# EAGLE design Puzzle_4-Digit Display v2.0 (EAGLE 6.6.0)
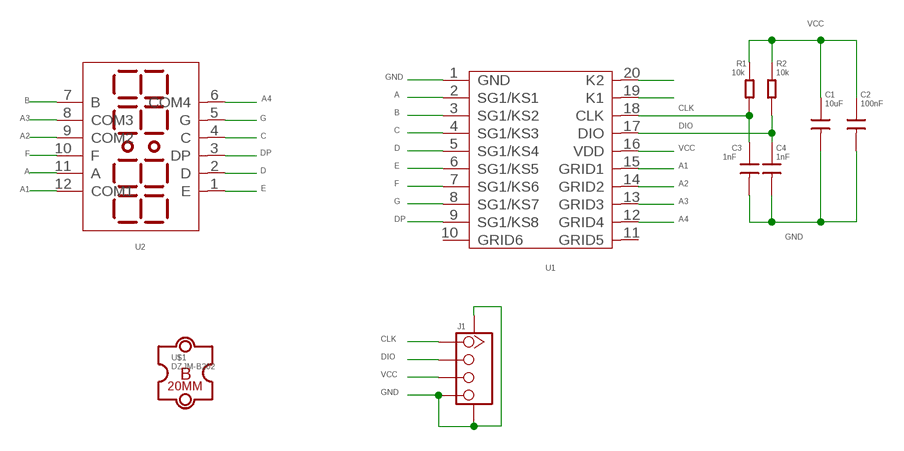
[diagram p0: schematic, sheet 1]

## Parts
C1  10uF  C-0603  [0603]
C2  100nF  C-0603  [0603]
C3  1nF  C-0603  [0603]
C4  1nF  C-0603  [0603]
J1  TWIG-4P-2.0-SMD-FEMALE-REINFORCE'90D'  [4P-SMD-2.0-90D]
R1  10k  R-0603  [0603]
R2  10k  R-0603  [0603]
U1  TM1637  [SOP20-10.45]
U2  LED-4-BETY-7-SEG  [7-4-BYTE-SEG-2.54-30X14X7.3H]
U$1  DZJM-B202  [DZJM-B20-2P]

## Nets
A: U1.2(SG1/KS1) U2.11(A)
A1: U1.15(GRID1) U2.12(COM1)
A2: U1.14(GRID2) U2.9(COM2)
A3: U1.13(GRID3) U2.8(COM3)
A4: U1.12(GRID4) U2.6(COM4)
B: U1.3(SG1/KS2) U2.7(B)
C: U1.4(SG1/KS3) U2.4(C)
CLK: C3.1 J1.1 R1.2 U1.18(CLK)
D: U1.5(SG1/KS4) U2.2(D)
DIO: C4.1 J1.2 R2.2 U1.17(DIO)
DP: U1.9(SG1/KS8) U2.3(DP)
E: U1.6(SG1/KS5) U2.1(E)
F: U1.7(SG1/KS6) U2.10(F)
G: U1.8(SG1/KS7) U2.5(G)
GND: C1.2 C2.2 C3.2 C4.2 J1.4 J1.SS1 J1.SS2 U1.1(GND)
N$17: U1.19(K1)
N$18: U1.20(K2)
VCC: C1.1 C2.1 J1.3 R1.1 R2.1 U1.16(VDD)
Unconnected: U1.10(GRID6) U1.11(GRID5)

## Library data of the parts
C1-C4 = Discrete:C*: Ceramic Capacitors
J1 = Connector:TWIG-4P-2.0-SMD-FEMALE-REINFORCE
R1 R2 = Discrete:R*
U1 = IC:TM1637
U2 = Module:LED-4-BETY-7-SEG
U$1 = duinofun-outline:DZJM-B20

## Board
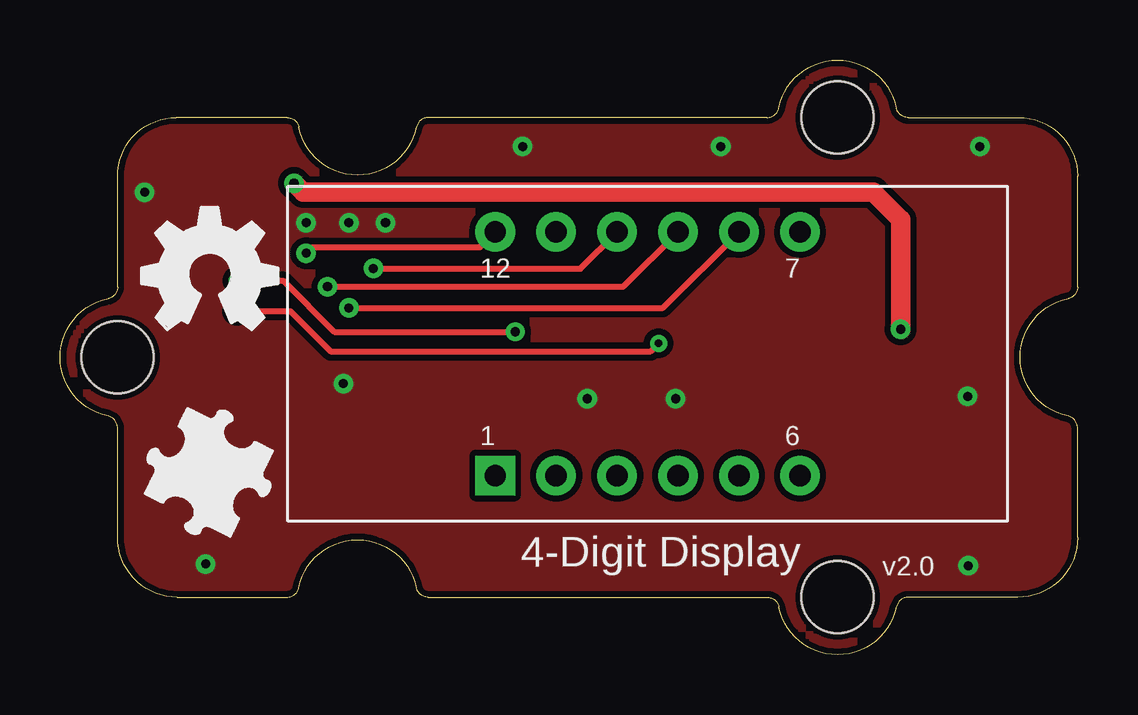
[diagram p1: board, top side]
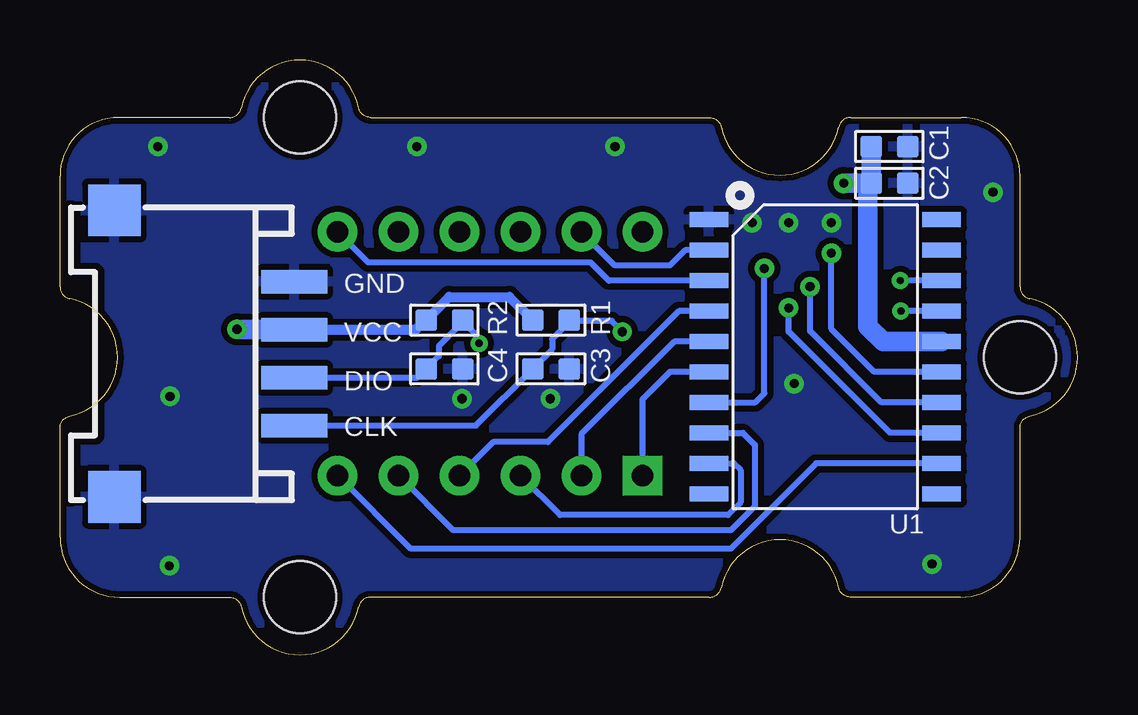
[diagram p2: board, bottom side, seen from below]

Size 42.4 x 24.8 mm. Coordinates in mm from the lower left corner, seen from the top.
Copper layers (1*16): Top 0.035mm / dielectric 1.5mm / Bottom 0.035mm
Design rules "default": minimum track width 10mil, minimum drill 12mil, track to track 8mil, track to pad 8mil, pad to pad 8mil, via to via 8mil, smd to smd 8mil, copper to edge 6mil, drill to drill 8mil, minimum pad ring 10mil, minimum via ring 8mil, stop-mask expansion 4mil, vias tented up to drill 100mil, thermal gap 10mil

### Footprints (pad centres in the part's own frame; a part is rotated, then mirrored left to right if it is on the bottom)
0603 = smd 0.889 x 0.889: 1 -0.762,0; 2 0.762,0
4P-SMD-2.0-90D = smd 0.965 x 2.74: 1 -3,-0.1; 2 -1,-0.1; 3 1,-0.1; 4 3,-0.1 | smd 2.159 x 2.184: SS1 -5.974,7.4; SS2 5.974,7.4
SOP20-10.45 = smd 0.635 x 1.6: 1 -5.715,-4.85; 2 -4.445,-4.85; 3 -3.175,-4.85; 4 -1.905,-4.85; 5 -0.635,-4.85; 6 0.635,-4.85; 7 1.905,-4.85; 8 3.175,-4.85; 9 4.445,-4.85; 10 5.715,-4.85; 11 5.715,4.85; 12 4.445,4.85; 13 3.175,4.85; 14 1.905,4.85; 15 0.635,4.85; 16 -0.635,4.85; 17 -1.905,4.85; 18 -3.175,4.85; 19 -4.445,4.85; 20 -5.715,4.85
7-4-BYTE-SEG-2.54-30X14X7.3H = drill 0.889 pad 1.651 square: 1 -6.35,-5.08 | drill 0.889 pad 1.651: 2 -3.81,-5.08; 3 -1.27,-5.08; 4 1.27,-5.08; 5 3.81,-5.08; 6 6.35,-5.08; 7 6.35,5.08; 8 3.81,5.08; 9 1.27,5.08; 10 -1.27,5.08; 11 -3.81,5.08; 12 -6.35,5.08
DZJM-B20-2P = hole 3: -10,10; -10,-10; 20,0

### Placement (x,y rotation side)
C1  7.85,21.19 0 bottom
C2  7.85,19.66 0 bottom
C3  21.94,11.92 0 bottom
C4  26.39,11.92 0 bottom
J1  32.74,12.55 90 bottom
R1  21.94,13.95 0 bottom
R2  26.39,13.95 0 bottom
U1  10.51,12.43 270 bottom
U2  24.48,12.55 0 top
U$1  22.4,12.4 180 top
U$2  [BRICK-LOGO-2-B-MIL-0.6]  9.24,4.55 0 bottom
U$12  [OSHW_FILLX200_NOTEXT]  3.4,13.57 0 top

### Tracks (layer width: path | path; a pad name or v marks a point on that pad's centre or on a via)
A
  Bottom 0.254: U1.2 16.36,16.87 16.99,16.24 19.28,16.24 U2.11
A1  (via drill 0.38 pad 0.81)
  Top 0.254: v10.26,16.74 10.51,17 17.5,17 U2.12
  Bottom 0.254: U1.15 8.46,11.79 10.26,13.59 v10.26,16.74
A2  (via drill 0.38 pad 0.81)
  Top 0.254: v11.15,15.35 23.47,15.35 U2.9
  Bottom 0.254: U1.14 8.17,10.52 11.15,13.5 v11.15,15.35
A3  (via drill 0.38 pad 0.81)
  Top 0.254: v12.04,14.46 25.12,14.46 U2.8
  Bottom 0.254: U1.13 7.82,9.25 12.04,13.47 v12.04,14.46
A4
  Bottom 0.254: U1.12 10.89,7.98 14.45,4.42 27.79,4.42 U2.6
B
  Bottom 0.254: U1.3 19.53,15.6 20.29,16.36 29.56,16.36 U2.7
C
  Bottom 0.254: U1.4 16.61,14.33 22.07,8.87 24.36,8.87 U2.4
CLK  (via drill 0.3 pad 0.64, 0.38 pad 0.3)
  Top 0.254: v7.39,15.6 9.29,15.6 11.43,13.47 v18.97,13.47
  Bottom 0.254: 21.18,13.92 21.18,13.87 21.89,13.16 21.89,12.73 C3.1 25.07,9.55 J1.1 | U1.18 v7.39,15.6 | v18.97,13.47 18.97,13.49 19.4,13.92 21.18,13.92 | 21.18,13.92 21.23,13.97 | 21.18,13.92 R1.2
D
  Bottom 0.254: U1.5 16.81,13.06 20.67,9.2 U2.2
DIO  (via drill 0.3 pad 0.64)
  Top 0.254: v7.36,14.33 9.6,14.33 11.28,12.65 24.61,12.65 v24.94,12.98
  Bottom 0.254: J1.2 27.52,11.55 C4.1 26.62,12.45 26.62,12.88 25.63,13.87 25.63,13.9 | R2.2 25.63,13.9 | U1.17 v7.36,14.33 | v24.94,12.98 24.94,13.21 25.63,13.9
DP
  Bottom 0.254: U1.9 14.32,7.98 14.05,7.7 14.05,6.35 14.58,5.82 21.56,5.82 U2.3
E
  Bottom 0.254: U1.6 16.99,11.79 18.13,10.65 U2.1 18.13,7.35
F  (via drill 0.38 pad 0.81)
  Top 0.254: v13.05,16.1 21.68,16.1 U2.10 | v13.05,16.1 13.05,15.98 | v13.05,16.11 v13.05,16.1
  Bottom 0.254: v13.05,16.11 13.05,10.9 13.43,10.52 U1.7
G
  Bottom 0.254: U1.8 13.94,9.25 13.45,8.76 13.45,6.19 14.45,5.19 26.01,5.19 U2.5
GND  (via drill 0.38 pad 0.81)
  other vias: 37.82,10.77 13.56,18.01 3.53,19.28 6.07,3.79 37.84,3.71 12.04,18.01 10.26,18.01 25.65,10.67 21.97,10.67 19.28,21.19 27.53,21.19 38.33,21.19 11.81,11.31
  pour Bottom (isolate 0.254): 0.35,24.74 42.26,24.74 42.26,0.11 0.35,0.11
  pour Top (isolate 0.254): 0.35,24.74 42.26,24.74 42.26,0.11 0.35,0.11
VCC  (via drill 0.38 pad 0.81)
  Top 0.813: v35.02,13.57 35.02,18.14 33.88,19.28 10.13,19.28 v9.75,19.66
  Bottom 0.406: J1.3 27.57,13.55 27.18,13.95 R2.1 26.18,14.92 23.67,14.92 R1.1
  Bottom 0.813: U1.16 8.1,13.06 8.74,13.7 8.74,19.54 C2.1 | C2.1 C1.1 | C2.1 v9.75,19.66 | v35.02,13.57 32.65,13.57 J1.3

### Text on the board
tPlace: 4-Digit Display | v2.0
bPlace: GND | VCC | DIO | CLK